# Altium schematic sheet 01_Table of Contents.SchDoc
size A3
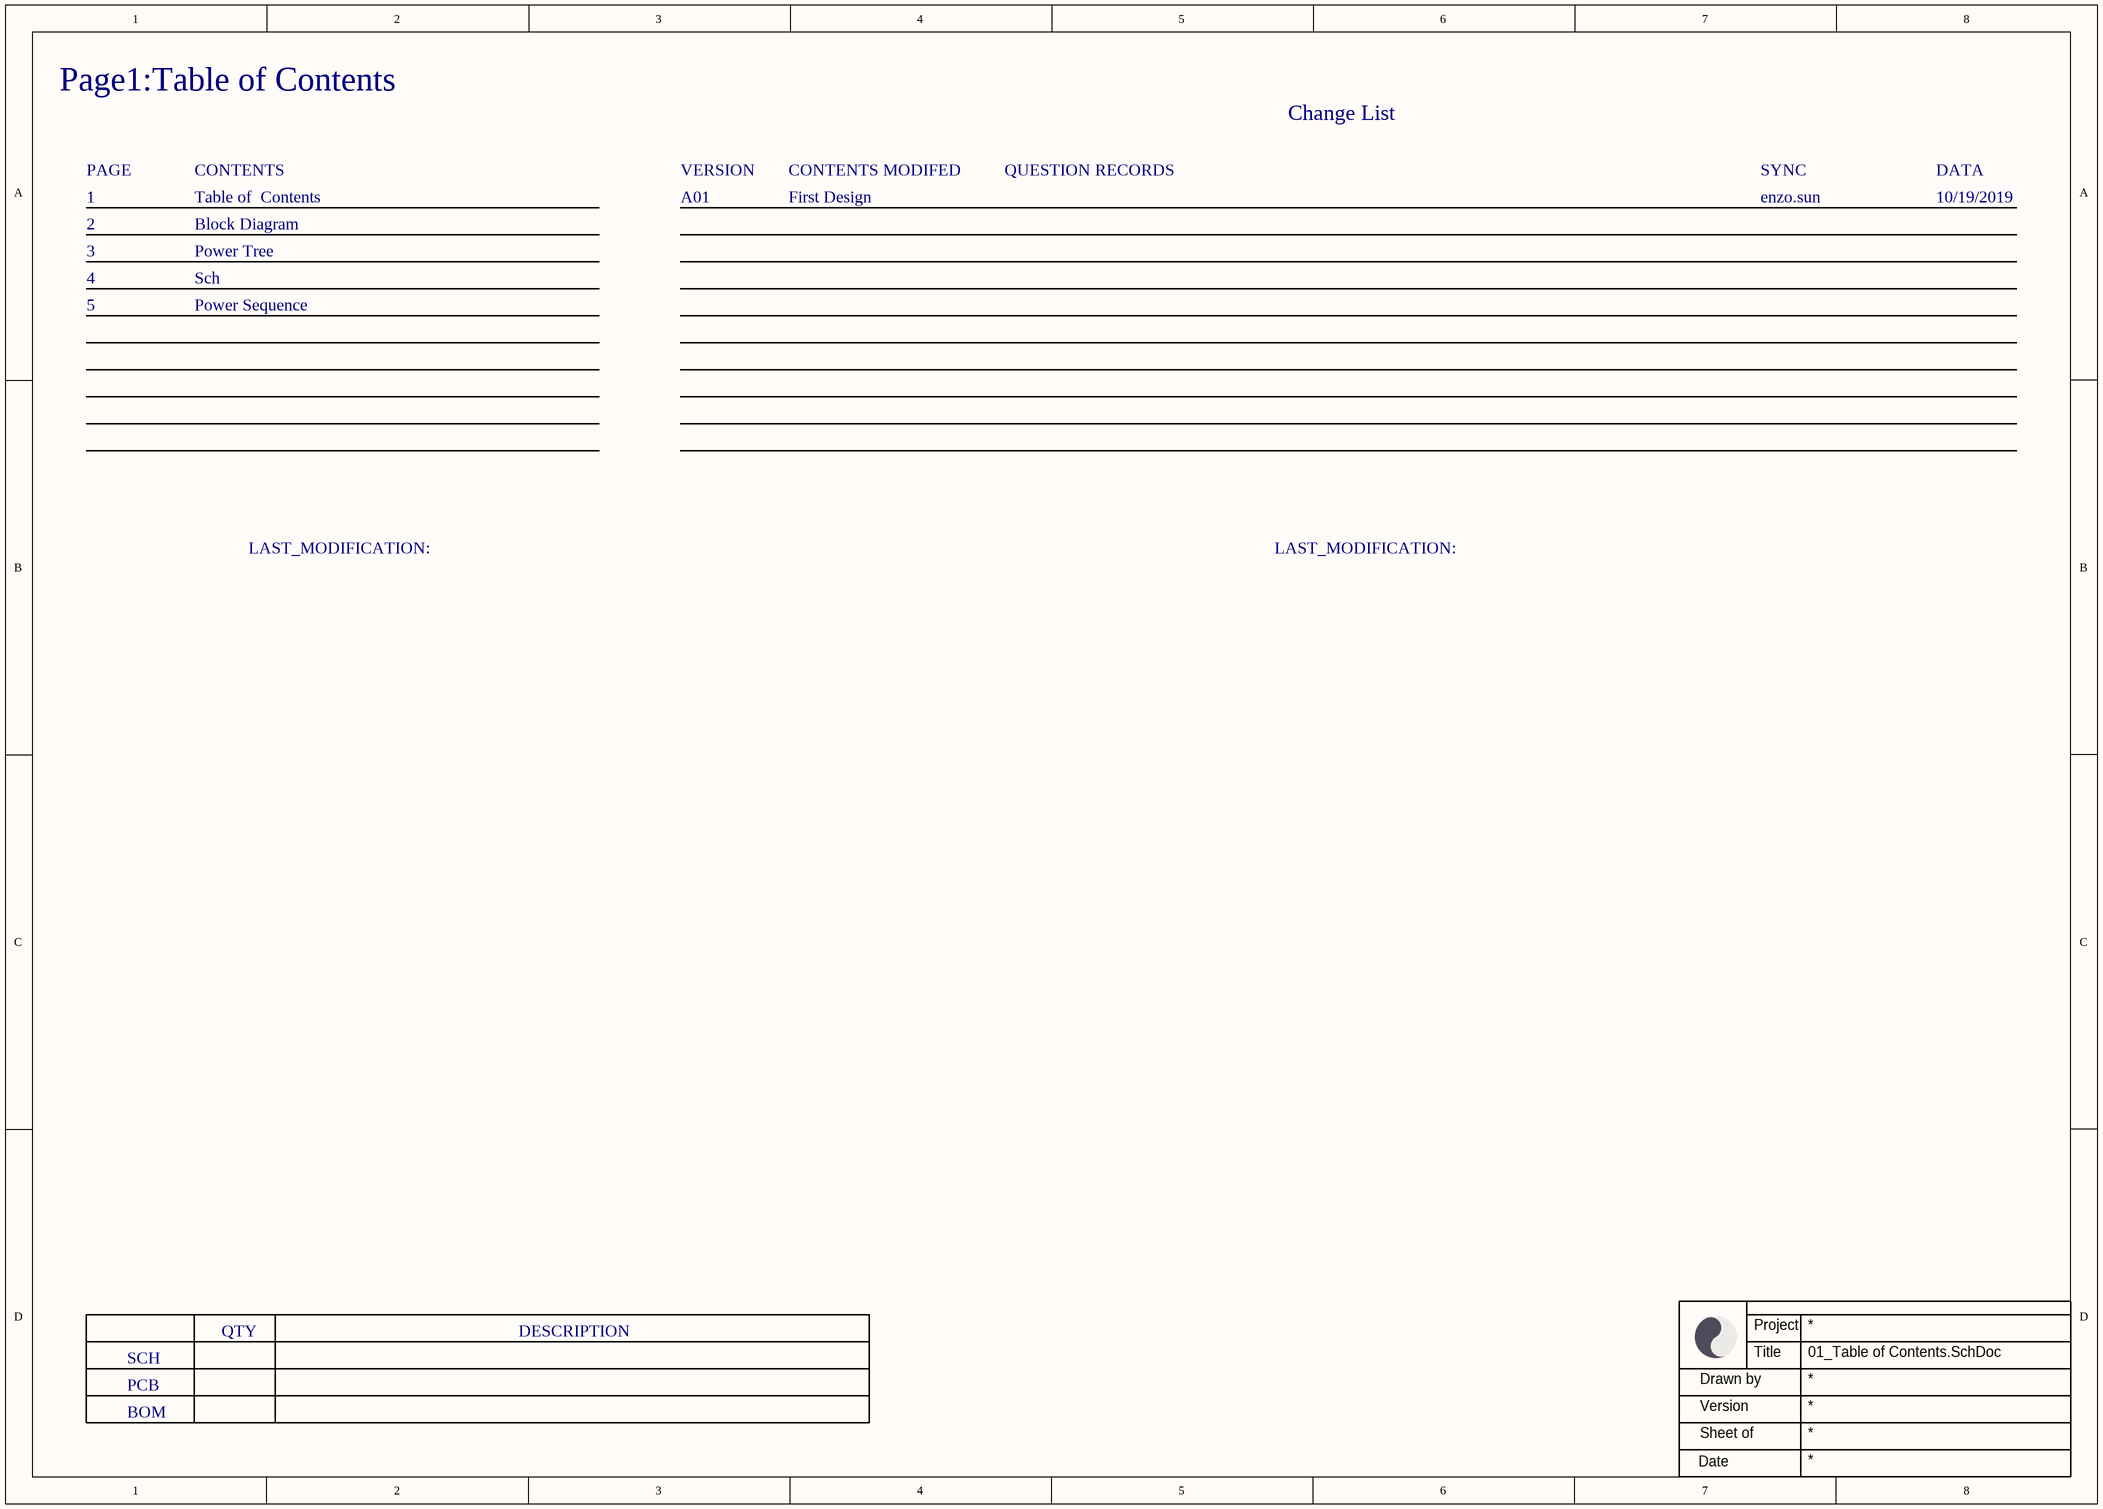
[diagram p0: 01_Table of Contents.SchDoc]

## Notes on the sheet
- Page1:Table of Contents
- PAGE
- CONTENTS
- VERSION
- CONTENTS MODIFED
- QUESTION RECORDS
- Change List
- SYNC
- DATA
- 1
- 2
- Table of  Contents
- Block Diagram
- A01
- First Design
- enzo.sun
- 10/19/2019
- 3
- 4
- 5
- Power Tree
- Sch
- Power Sequence
- LAST_MODIFICATION:
- SCH
- PCB
- QTY
- DESCRIPTION
- BOM
- Drawn by
- Project
- Title
- Version
- Sheet of
- Date